# EAGLE board AddSub (EAGLE 8.5.1), part 1 of 2
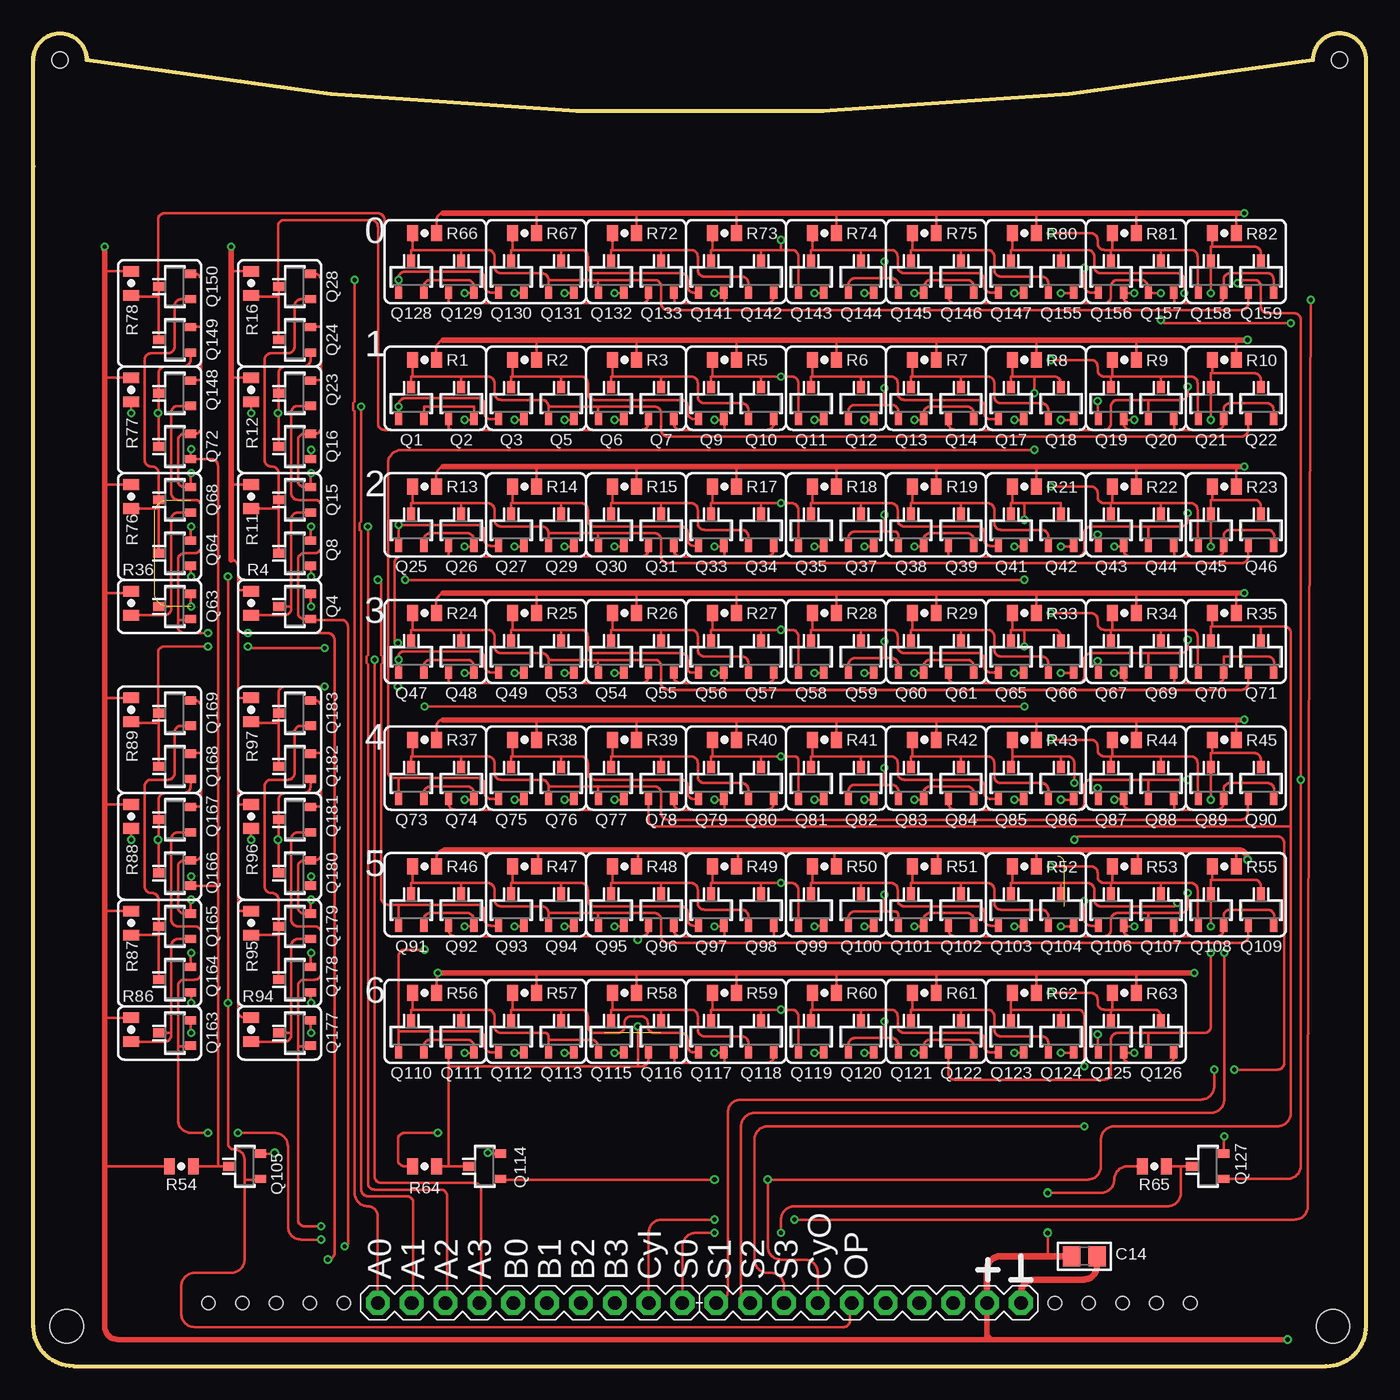
[diagram p2: board, top side]
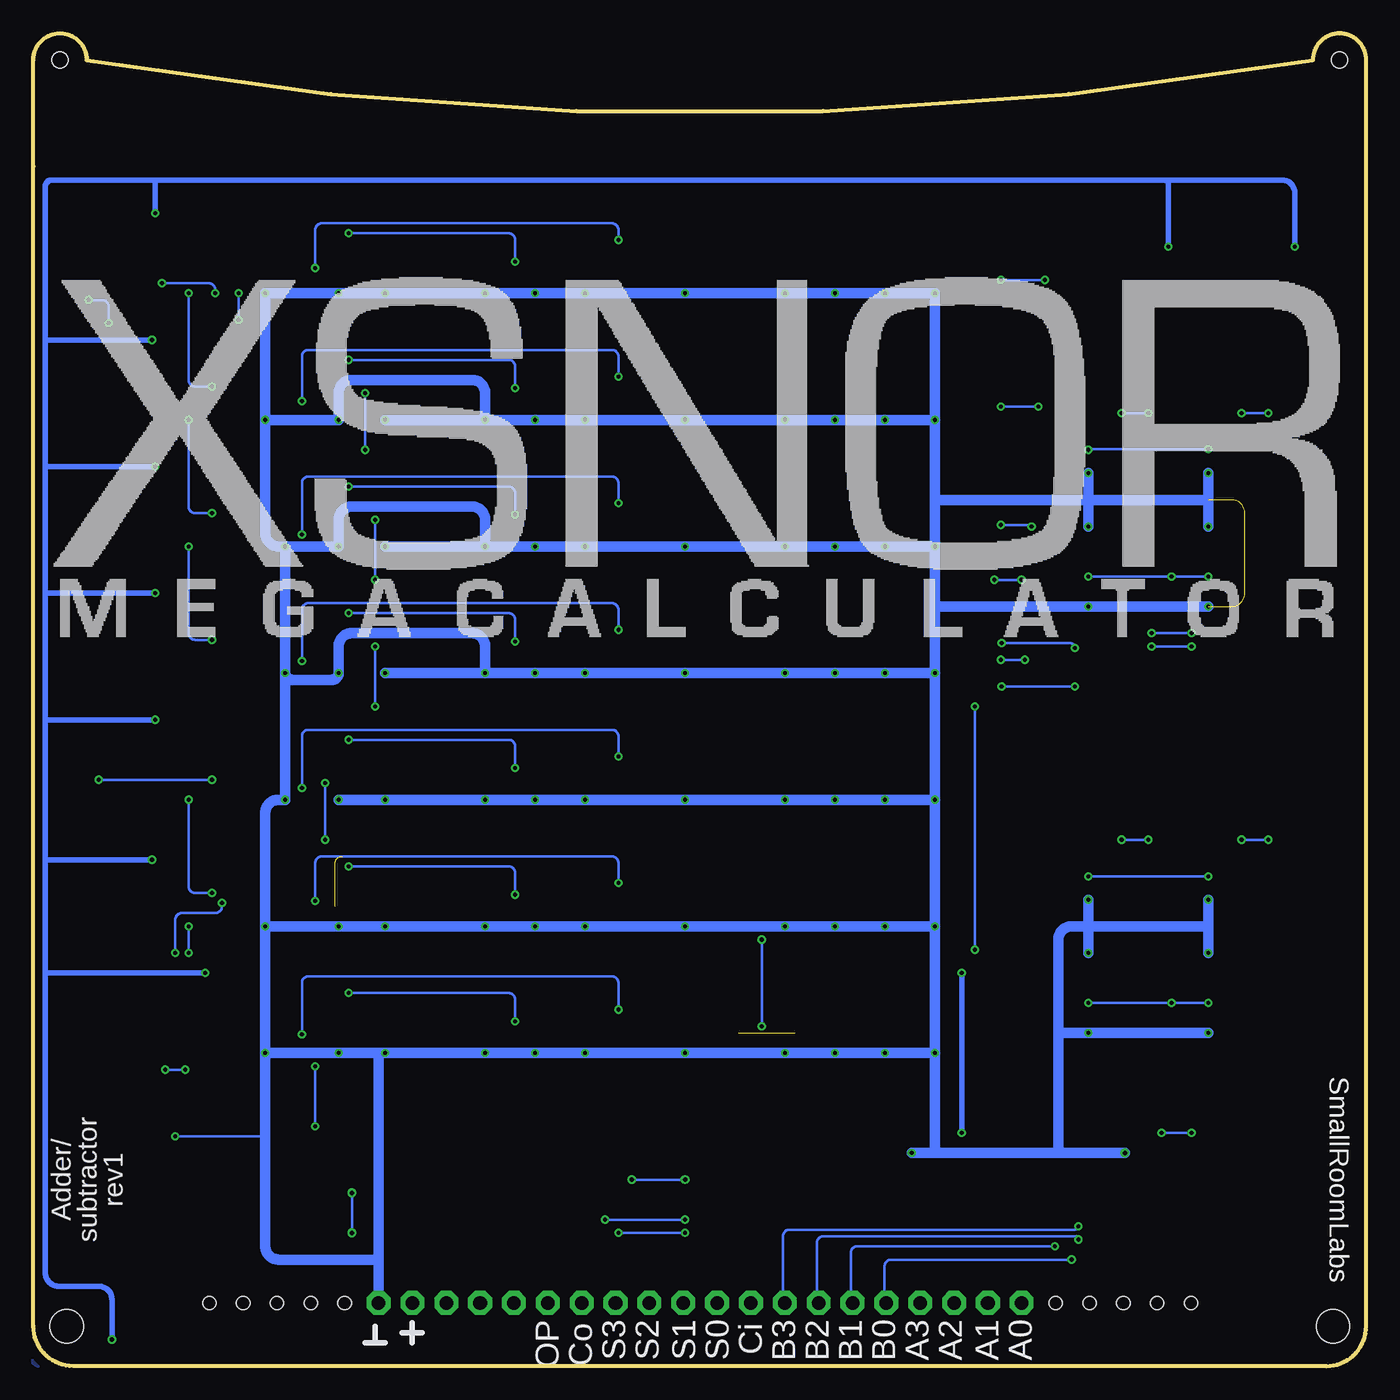
[diagram p3: board, bottom side, seen from below]

Size 100 x 100 mm. Coordinates in mm from the lower left corner, seen from the top.
Outline: 3,0 arc-90 0,3 0,90 0,98 arc-90 2,100 arc-90 4,98 arc20 96,98 arc-90 98,100 arc-90 100,98 100,90 100,3 arc-90 97,0 3,0
Copper layers (1*16): Top 0.035mm / dielectric 1.5mm / Bottom 0.035mm
Design rules "dirt_cheap_dirty_boards.v1": minimum track width 5mil, minimum drill 12mil, track to track 5mil, track to pad 5mil, pad to pad 5mil, via to via 5mil, smd to smd 0mil, copper to edge 10mil, drill to drill 10mil, minimum pad ring 10mil, minimum via ring 6mil, stop-mask expansion 2mil, vias tented up to drill 25mil, thermal gap 10mil
Net classes: 0 default: width 0.2 mm, drill 0.305 mm, clearance 0.2 mm; 1 narrow: width 0.2 mm, drill 0.305 mm, clearance 0.2 mm
Holes 2.5 mm at 2.5,3 97.5,3
Holes 1.2 mm at 2,98 98,98
Holes 1 mm at 13.14,4.75 15.68,4.75 18.22,4.75 20.76,4.75 23.3,4.75 76.64,4.75 79.18,4.75 81.72,4.75 84.26,4.75 86.8,4.75

## Footprints (pad centres in the part's own frame; a part is rotated, then mirrored left to right if it is on the bottom)
C0805 = smd 1.3 x 1.5: 1 -0.95,0; 2 0.95,0
1X20/90 = drill 1.016 pad 1.778 octagon: 1 -24.13,0; 2 -21.59,0; 3 -19.05,0; 4 -16.51,0; 5 -13.97,0; 6 -11.43,0; 7 -8.89,0; 8 -6.35,0; 9 -3.81,0; 10 -1.27,0; 11 1.27,0; 12 3.81,0; 13 6.35,0; 14 8.89,0; 15 11.43,0; 16 13.97,0; 17 16.51,0; 18 19.05,0; 19 21.59,0; 20 24.13,0
SOT23 = smd 0.6 x 0.9: 1 -0.95,-1.2; 2 0.95,-1.2 | smd 0.65 x 0.9: 3 0,1.2
0805 = smd 0.8 x 1.2: 1 -0.9,0; 2 0.9,0

## Placement (x,y rotation side)
C14  [C0805]  78.85,8.25 0 top
J1  [1X20/90]  49.97,4.75 0 top
Q1  310mA/60V/1.6Ω  [SOT23]  28.35,72.25 0 top
Q2  310mA/60V/1.6Ω  [SOT23]  32.1,72.25 0 top
Q3  310mA/60V/1.6Ω  [SOT23]  35.85,72.25 0 top
Q4  310mA/60V/1.6Ω  [SOT23]  19.6,57 90 top
Q5  310mA/60V/1.6Ω  [SOT23]  39.6,72.25 0 top
Q6  310mA/60V/1.6Ω  [SOT23]  43.35,72.25 0 top
Q7  310mA/60V/1.6Ω  [SOT23]  47.1,72.25 0 top
Q8  310mA/60V/1.6Ω  [SOT23]  19.6,61 90 top
Q9  310mA/60V/1.6Ω  [SOT23]  50.85,72.25 0 top
Q10  310mA/60V/1.6Ω  [SOT23]  54.6,72.25 0 top
Q11  310mA/60V/1.6Ω  [SOT23]  58.35,72.25 0 top
Q12  310mA/60V/1.6Ω  [SOT23]  62.1,72.25 0 top
Q13  310mA/60V/1.6Ω  [SOT23]  65.85,72.25 0 top
Q14  310mA/60V/1.6Ω  [SOT23]  69.6,72.25 0 top
Q15  310mA/60V/1.6Ω  [SOT23]  19.6,65 90 top
Q16  310mA/60V/1.6Ω  [SOT23]  19.6,69 90 top
Q17  310mA/60V/1.6Ω  [SOT23]  73.35,72.25 0 top
Q18  310mA/60V/1.6Ω  [SOT23]  77.1,72.25 0 top
Q19  310mA/60V/1.6Ω  [SOT23]  80.85,72.25 0 top
Q20  310mA/60V/1.6Ω  [SOT23]  84.6,72.25 0 top
Q21  310mA/60V/1.6Ω  [SOT23]  88.35,72.25 0 top
Q22  310mA/60V/1.6Ω  [SOT23]  92.1,72.25 0 top
Q23  310mA/60V/1.6Ω  [SOT23]  19.6,73 90 top
Q24  310mA/60V/1.6Ω  [SOT23]  19.6,77 90 top
Q25  310mA/60V/1.6Ω  [SOT23]  28.35,62.75 0 top
Q26  310mA/60V/1.6Ω  [SOT23]  32.1,62.75 0 top
Q27  310mA/60V/1.6Ω  [SOT23]  35.85,62.75 0 top
Q28  310mA/60V/1.6Ω  [SOT23]  19.6,81 90 top
Q29  310mA/60V/1.6Ω  [SOT23]  39.6,62.75 0 top
Q30  310mA/60V/1.6Ω  [SOT23]  43.35,62.75 0 top
Q31  310mA/60V/1.6Ω  [SOT23]  47.1,62.75 0 top
Q33  310mA/60V/1.6Ω  [SOT23]  50.85,62.75 0 top
Q34  310mA/60V/1.6Ω  [SOT23]  54.6,62.75 0 top
Q35  310mA/60V/1.6Ω  [SOT23]  58.35,62.75 0 top
Q37  310mA/60V/1.6Ω  [SOT23]  62.1,62.75 0 top
Q38  310mA/60V/1.6Ω  [SOT23]  65.85,62.75 0 top
Q39  310mA/60V/1.6Ω  [SOT23]  69.6,62.75 0 top
Q41  310mA/60V/1.6Ω  [SOT23]  73.35,62.75 0 top
Q42  310mA/60V/1.6Ω  [SOT23]  77.1,62.75 0 top
Q43  310mA/60V/1.6Ω  [SOT23]  80.85,62.75 0 top
Q44  310mA/60V/1.6Ω  [SOT23]  84.6,62.75 0 top
Q45  310mA/60V/1.6Ω  [SOT23]  88.35,62.75 0 top
Q46  310mA/60V/1.6Ω  [SOT23]  92.1,62.75 0 top
Q47  310mA/60V/1.6Ω  [SOT23]  28.35,53.25 0 top
Q48  310mA/60V/1.6Ω  [SOT23]  32.1,53.25 0 top
Q49  310mA/60V/1.6Ω  [SOT23]  35.85,53.25 0 top
Q53  310mA/60V/1.6Ω  [SOT23]  39.6,53.25 0 top
Q54  310mA/60V/1.6Ω  [SOT23]  43.35,53.25 0 top
Q55  310mA/60V/1.6Ω  [SOT23]  47.1,53.25 0 top
Q56  310mA/60V/1.6Ω  [SOT23]  50.85,53.25 0 top
Q57  310mA/60V/1.6Ω  [SOT23]  54.6,53.25 0 top
Q58  310mA/60V/1.6Ω  [SOT23]  58.35,53.25 0 top
Q59  310mA/60V/1.6Ω  [SOT23]  62.1,53.25 0 top
Q60  310mA/60V/1.6Ω  [SOT23]  65.85,53.25 0 top
Q61  310mA/60V/1.6Ω  [SOT23]  69.6,53.25 0 top
Q63  310mA/60V/1.6Ω  [SOT23]  10.6,57 90 top
Q64  310mA/60V/1.6Ω  [SOT23]  10.6,61 90 top
Q65  310mA/60V/1.6Ω  [SOT23]  73.35,53.25 0 top
Q66  310mA/60V/1.6Ω  [SOT23]  77.1,53.25 0 top
Q67  310mA/60V/1.6Ω  [SOT23]  80.85,53.25 0 top
Q68  310mA/60V/1.6Ω  [SOT23]  10.6,65 90 top
Q69  310mA/60V/1.6Ω  [SOT23]  84.6,53.25 0 top
Q70  310mA/60V/1.6Ω  [SOT23]  88.35,53.25 0 top
Q71  310mA/60V/1.6Ω  [SOT23]  92.1,53.25 0 top
Q72  310mA/60V/1.6Ω  [SOT23]  10.6,69 90 top
Q73  310mA/60V/1.6Ω  [SOT23]  28.35,43.75 0 top
Q74  310mA/60V/1.6Ω  [SOT23]  32.1,43.75 0 top
Q75  310mA/60V/1.6Ω  [SOT23]  35.85,43.75 0 top
Q76  310mA/60V/1.6Ω  [SOT23]  39.6,43.75 0 top
Q77  310mA/60V/1.6Ω  [SOT23]  43.35,43.75 0 top
Q78  310mA/60V/1.6Ω  [SOT23]  47.1,43.75 0 top
Q79  310mA/60V/1.6Ω  [SOT23]  50.85,43.75 0 top
Q80  310mA/60V/1.6Ω  [SOT23]  54.6,43.75 0 top
Q81  310mA/60V/1.6Ω  [SOT23]  58.35,43.75 0 top
Q82  310mA/60V/1.6Ω  [SOT23]  62.1,43.75 0 top
Q83  310mA/60V/1.6Ω  [SOT23]  65.85,43.75 0 top
Q84  310mA/60V/1.6Ω  [SOT23]  69.6,43.75 0 top
Q85  310mA/60V/1.6Ω  [SOT23]  73.35,43.75 0 top
Q86  310mA/60V/1.6Ω  [SOT23]  77.1,43.75 0 top
Q87  310mA/60V/1.6Ω  [SOT23]  80.85,43.75 0 top
Q88  310mA/60V/1.6Ω  [SOT23]  84.6,43.75 0 top
Q89  310mA/60V/1.6Ω  [SOT23]  88.35,43.75 0 top
Q90  310mA/60V/1.6Ω  [SOT23]  92.1,43.75 0 top
Q91  310mA/60V/1.6Ω  [SOT23]  28.35,34.25 0 top
Q92  310mA/60V/1.6Ω  [SOT23]  32.1,34.25 0 top
Q93  310mA/60V/1.6Ω  [SOT23]  35.85,34.25 0 top
Q94  310mA/60V/1.6Ω  [SOT23]  39.6,34.25 0 top
Q95  310mA/60V/1.6Ω  [SOT23]  43.35,34.25 0 top
Q96  310mA/60V/1.6Ω  [SOT23]  47.1,34.25 0 top
Q97  310mA/60V/1.6Ω  [SOT23]  50.85,34.25 0 top
Q98  310mA/60V/1.6Ω  [SOT23]  54.6,34.25 0 top
Q99  310mA/60V/1.6Ω  [SOT23]  58.35,34.25 0 top
Q100  310mA/60V/1.6Ω  [SOT23]  62.1,34.25 0 top
Q101  310mA/60V/1.6Ω  [SOT23]  65.85,34.25 0 top
Q102  310mA/60V/1.6Ω  [SOT23]  69.6,34.25 0 top
Q103  310mA/60V/1.6Ω  [SOT23]  73.35,34.25 0 top
Q104  310mA/60V/1.6Ω  [SOT23]  77.1,34.25 0 top
Q105  310mA/60V/1.6Ω  [SOT23]  15.85,15 90 top
Q106  310mA/60V/1.6Ω  [SOT23]  80.85,34.25 0 top
Q107  310mA/60V/1.6Ω  [SOT23]  84.6,34.25 0 top
Q108  310mA/60V/1.6Ω  [SOT23]  88.35,34.25 0 top
Q109  310mA/60V/1.6Ω  [SOT23]  92.1,34.25 0 top
Q110  310mA/60V/1.6Ω  [SOT23]  28.35,24.75 0 top
Q111  310mA/60V/1.6Ω  [SOT23]  32.1,24.75 0 top
Q112  310mA/60V/1.6Ω  [SOT23]  35.85,24.75 0 top
Q113  310mA/60V/1.6Ω  [SOT23]  39.6,24.75 0 top
Q114  310mA/60V/1.6Ω  [SOT23]  33.85,15 90 top
Q115  310mA/60V/1.6Ω  [SOT23]  43.35,24.75 0 top
Q116  310mA/60V/1.6Ω  [SOT23]  47.1,24.75 0 top
Q117  310mA/60V/1.6Ω  [SOT23]  50.85,24.75 0 top
Q118  310mA/60V/1.6Ω  [SOT23]  54.6,24.75 0 top
Q119  310mA/60V/1.6Ω  [SOT23]  58.35,24.75 0 top
Q120  310mA/60V/1.6Ω  [SOT23]  62.1,24.75 0 top
Q121  310mA/60V/1.6Ω  [SOT23]  65.85,24.75 0 top
Q122  310mA/60V/1.6Ω  [SOT23]  69.6,24.75 0 top
Q123  310mA/60V/1.6Ω  [SOT23]  73.35,24.75 0 top
Q124  310mA/60V/1.6Ω  [SOT23]  77.1,24.75 0 top
Q125  310mA/60V/1.6Ω  [SOT23]  80.85,24.75 0 top
Q126  310mA/60V/1.6Ω  [SOT23]  84.6,24.75 0 top
Q127  310mA/60V/1.6Ω  [SOT23]  88.1,15 90 top
Q128  310mA/60V/1.6Ω  [SOT23]  28.35,81.75 0 top
Q129  310mA/60V/1.6Ω  [SOT23]  32.1,81.75 0 top
Q130  310mA/60V/1.6Ω  [SOT23]  35.85,81.75 0 top
Q131  310mA/60V/1.6Ω  [SOT23]  39.6,81.75 0 top
Q132  310mA/60V/1.6Ω  [SOT23]  43.35,81.75 0 top
Q133  310mA/60V/1.6Ω  [SOT23]  47.1,81.75 0 top
Q141  310mA/60V/1.6Ω  [SOT23]  50.85,81.75 0 top
Q142  310mA/60V/1.6Ω  [SOT23]  54.6,81.75 0 top
Q143  310mA/60V/1.6Ω  [SOT23]  58.35,81.75 0 top
Q144  310mA/60V/1.6Ω  [SOT23]  62.1,81.75 0 top
Q145  310mA/60V/1.6Ω  [SOT23]  65.85,81.75 0 top
Q146  310mA/60V/1.6Ω  [SOT23]  69.6,81.75 0 top
Q147  310mA/60V/1.6Ω  [SOT23]  73.35,81.75 0 top
Q148  310mA/60V/1.6Ω  [SOT23]  10.6,73 90 top
Q149  310mA/60V/1.6Ω  [SOT23]  10.6,77 90 top
Q150  310mA/60V/1.6Ω  [SOT23]  10.6,81 90 top
Q155  310mA/60V/1.6Ω  [SOT23]  77.1,81.75 0 top
Q156  310mA/60V/1.6Ω  [SOT23]  80.85,81.75 0 top
Q157  310mA/60V/1.6Ω  [SOT23]  84.6,81.75 0 top
Q158  310mA/60V/1.6Ω  [SOT23]  88.35,81.75 0 top
Q159  310mA/60V/1.6Ω  [SOT23]  92.1,81.75 0 top
Q163  310mA/60V/1.6Ω  [SOT23]  10.6,25 90 top
Q164  310mA/60V/1.6Ω  [SOT23]  10.6,29 90 top
Q165  310mA/60V/1.6Ω  [SOT23]  10.6,33 90 top
Q166  310mA/60V/1.6Ω  [SOT23]  10.6,37 90 top
Q167  310mA/60V/1.6Ω  [SOT23]  10.6,41 90 top
Q168  310mA/60V/1.6Ω  [SOT23]  10.6,45 90 top
Q169  310mA/60V/1.6Ω  [SOT23]  10.6,49 90 top
Q177  310mA/60V/1.6Ω  [SOT23]  19.6,25 90 top
Q178  310mA/60V/1.6Ω  [SOT23]  19.6,29 90 top
Q179  310mA/60V/1.6Ω  [SOT23]  19.6,33 90 top
Q180  310mA/60V/1.6Ω  [SOT23]  19.6,37 90 top
Q181  310mA/60V/1.6Ω  [SOT23]  19.6,41 90 top
Q182  310mA/60V/1.6Ω  [SOT23]  19.6,45 90 top
Q183  310mA/60V/1.6Ω  [SOT23]  19.6,49 90 top
R1  [0805]  29.35,75.5 0 top
R2  [0805]  36.85,75.5 0 top
R3  [0805]  44.35,75.5 0 top
R4  [0805]  16.35,57.25 90 top
R5  [0805]  51.85,75.5 0 top
R6  [0805]  59.35,75.5 0 top
R7  [0805]  66.85,75.5 0 top
R8  [0805]  74.35,75.5 0 top
R9  [0805]  81.85,75.5 0 top
R10  [0805]  89.35,75.5 0 top
R11  [0805]  16.35,65.25 90 top
R12  [0805]  16.35,73.25 90 top
R13  [0805]  29.35,66 0 top
R14  [0805]  36.85,66 0 top
R15  [0805]  44.35,66 0 top
R16  [0805]  16.35,81.25 90 top
R17  [0805]  51.85,66 0 top
R18  [0805]  59.35,66 0 top
R19  [0805]  66.85,66 0 top
R21  [0805]  74.35,66 0 top
R22  [0805]  81.85,66 0 top
R23  [0805]  89.35,66 0 top
R24  [0805]  29.35,56.5 0 top
R25  [0805]  36.85,56.5 0 top
R26  [0805]  44.35,56.5 0 top
R27  [0805]  51.85,56.5 0 top
R28  [0805]  59.35,56.5 0 top
R29  [0805]  66.85,56.5 0 top
R33  [0805]  74.35,56.5 0 top
R34  [0805]  81.85,56.5 0 top
R35  [0805]  89.35,56.5 0 top
R36  [0805]  7.35,57.25 90 top
R37  [0805]  29.35,47 0 top
R38  [0805]  36.85,47 0 top
R39  [0805]  44.35,47 0 top
R40  [0805]  51.85,47 0 top
R41  [0805]  59.35,47 0 top
R42  [0805]  66.85,47 0 top
R43  [0805]  74.35,47 0 top
R44  [0805]  81.85,47 0 top
R45  [0805]  89.35,47 0 top
R46  [0805]  29.35,37.5 0 top
R47  [0805]  36.85,37.5 0 top
R48  [0805]  44.35,37.5 0 top
R49  [0805]  51.85,37.5 0 top
R50  [0805]  59.35,37.5 0 top
R51  [0805]  66.85,37.5 0 top
R52  [0805]  74.35,37.5 0 top
R53  [0805]  81.85,37.5 0 top
R54  [0805]  11.1,15 180 top
R55  [0805]  89.35,37.5 0 top
R56  [0805]  29.35,28 0 top
R57  [0805]  36.85,28 0 top
R58  [0805]  44.35,28 0 top
R59  [0805]  51.85,28 0 top
R60  [0805]  59.35,28 0 top
R61  [0805]  66.85,28 0 top
R62  [0805]  74.35,28 0 top
R63  [0805]  81.85,28 0 top
R64  [0805]  29.35,15 180 top
R65  [0805]  84.1,15 180 top
R66  [0805]  29.35,85 0 top
R67  [0805]  36.85,85 0 top
R72  [0805]  44.35,85 0 top
R73  [0805]  51.85,85 0 top
R74  [0805]  59.35,85 0 top
R75  [0805]  66.85,85 0 top
R76  [0805]  7.35,65.25 90 top
R77  [0805]  7.35,73.25 90 top
R78  [0805]  7.35,81.25 90 top
R80  [0805]  74.35,85 0 top
R81  [0805]  81.85,85 0 top
R82  [0805]  89.35,85 0 top
R86  [0805]  7.35,25.25 90 top
R87  [0805]  7.35,33.25 90 top
R88  [0805]  7.35,41.25 90 top
R89  [0805]  7.35,49.25 90 top
R94  [0805]  16.35,25.25 90 top
R95  [0805]  16.35,33.25 90 top
R96  [0805]  16.35,41.25 90 top
R97  [0805]  16.35,49.25 90 top